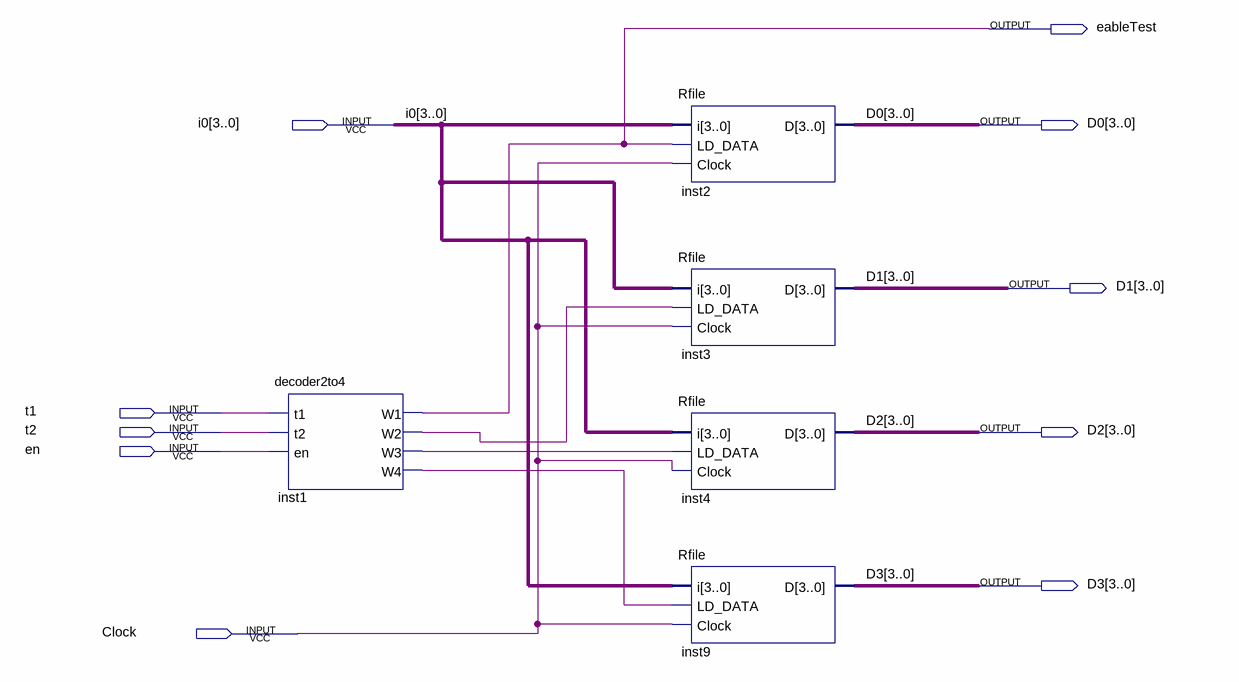
[diagram p0: schematic sheet]
// Quartus schematic Register.bdf as structural Verilog: 5 symbols, 10 pins
module Register (
  input  [3:0] i0,
  input  t1,
  input  t2,
  input  en,
  input  Clock,
  output eableTest,
  output [3:0] D0,
  output [3:0] D1,
  output [3:0] D2,
  output [3:0] D3
);

  wire inst1_w2, inst1_w3, inst1_w4;

  decoder2to4 inst1 (.t1(t1), .t2(t2), .en(en), .W1(eableTest), .W2(inst1_w2), .W3(inst1_w3), .W4(inst1_w4));
  Rfile inst2 (.i(i0), .LD_DATA(eableTest), .Clock(Clock), .D(D0));
  Rfile inst3 (.i(i0), .LD_DATA(inst1_w2), .Clock(Clock), .D(D1));
  Rfile inst4 (.i(i0), .LD_DATA(inst1_w3), .Clock(Clock), .D(D2));
  Rfile inst9 (.i(i0), .LD_DATA(inst1_w4), .Clock(Clock), .D(D3));
endmodule
